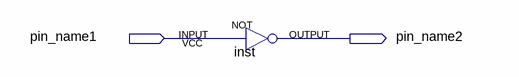
[diagram p0: schematic sheet]
// Quartus schematic Aula2.bdf as structural Verilog: 1 symbols, 2 pins
module Aula2 (
  input  pin_name1,
  output pin_name2
);

  not inst (pin_name2, pin_name1);
endmodule
